# EAGLE design dekatron-sim-4017 (EAGLE 6.4)
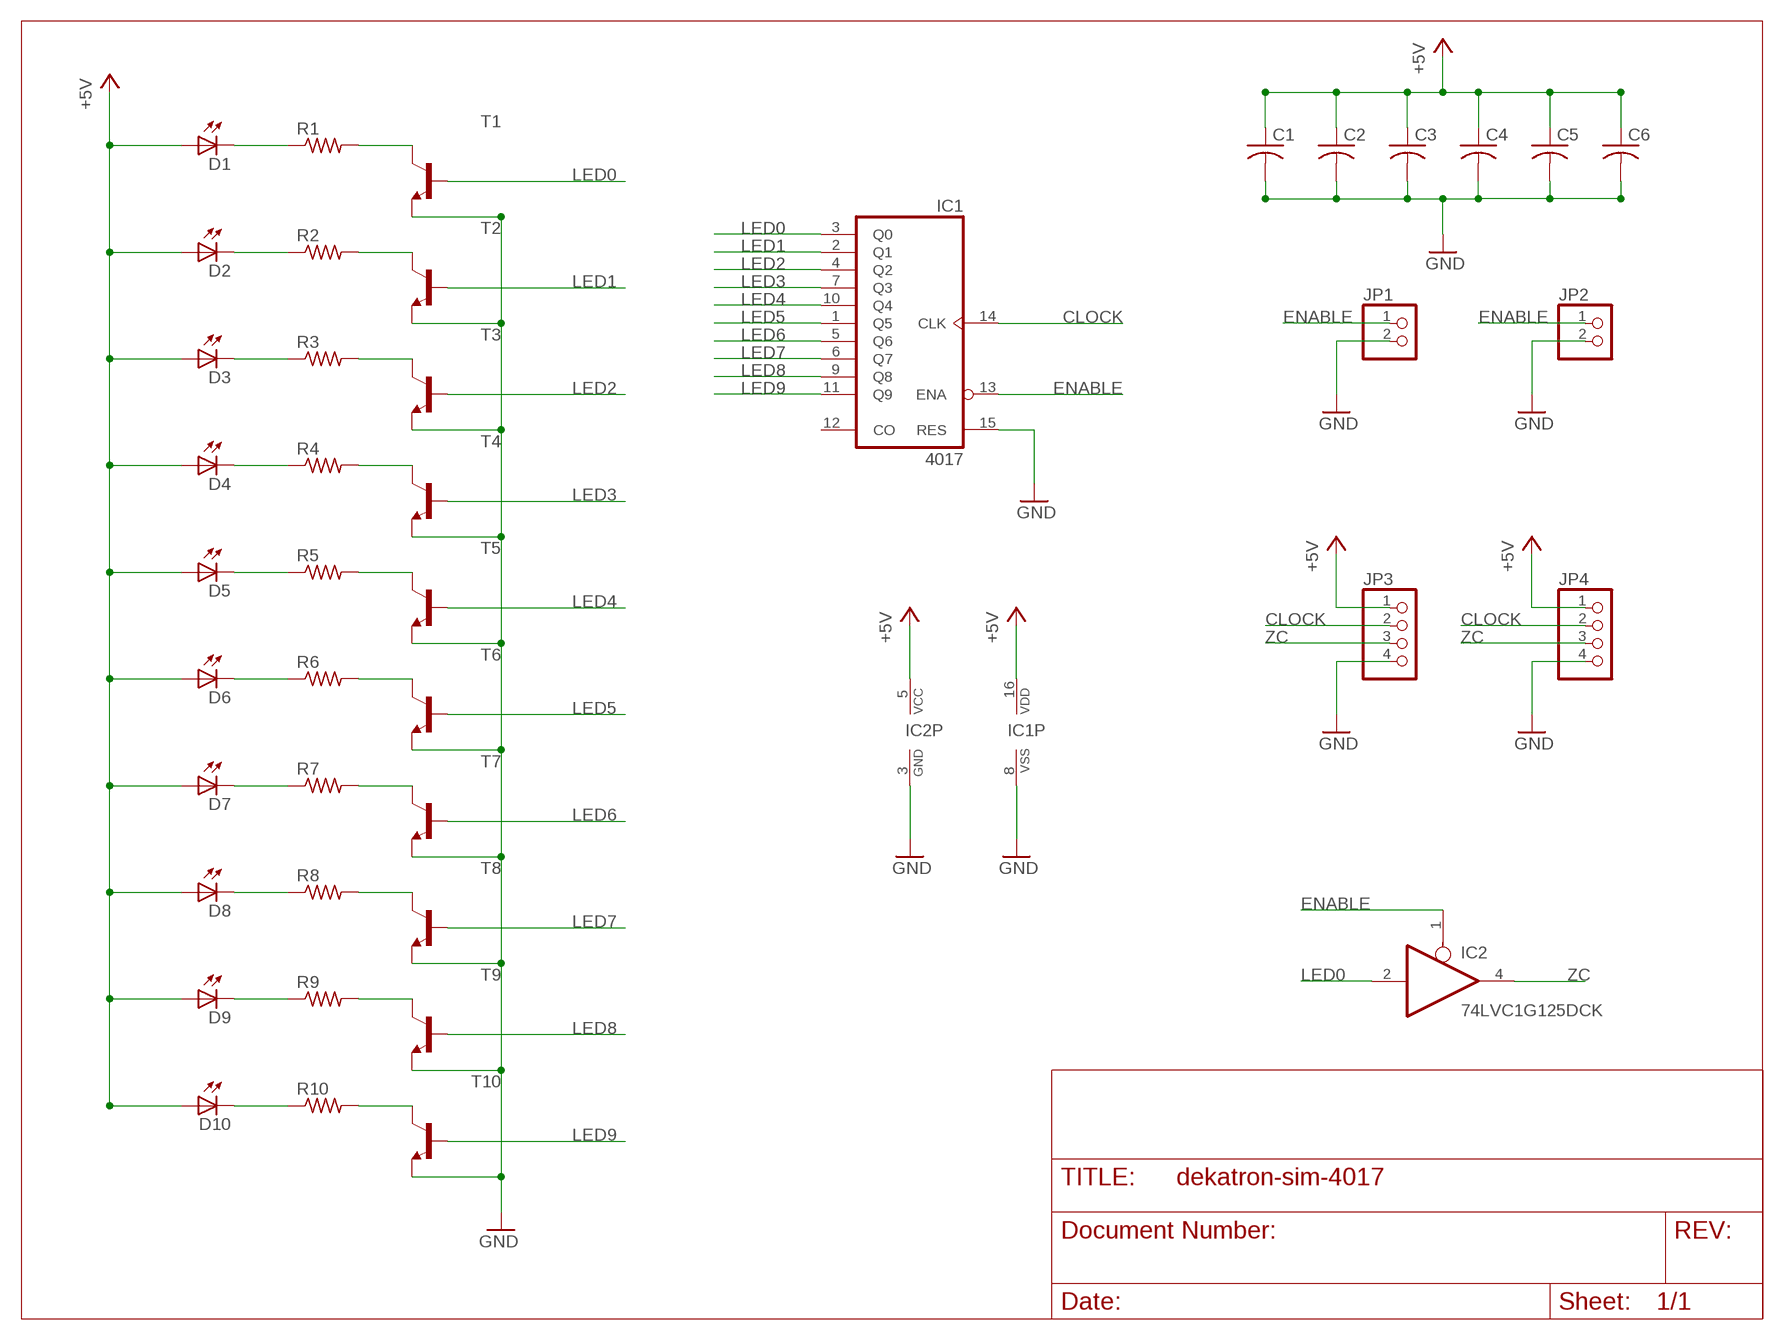
[diagram p0: schematic, sheet 1]

## Parts
C1  C-USC0805  [C0805]
C2  C-USC0805  [C0805]
C3  C-USC0805  [C0805]
C4  C-USC0805  [C0805]
C5  C-USC0805  [C0805]
C6  C-USC0805  [C0805]
D1  RED  LEDCHIP-LED0603  [CHIP-LED0603]
D2  RED  LEDCHIP-LED0603  [CHIP-LED0603]
D3  RED  LEDCHIP-LED0603  [CHIP-LED0603]
D4  RED  LEDCHIP-LED0603  [CHIP-LED0603]
D5  RED  LEDCHIP-LED0603  [CHIP-LED0603]
D6  RED  LEDCHIP-LED0603  [CHIP-LED0603]
D7  RED  LEDCHIP-LED0603  [CHIP-LED0603]
D8  RED  LEDCHIP-LED0603  [CHIP-LED0603]
D9  RED  LEDCHIP-LED0603  [CHIP-LED0603]
D10  RED  LEDCHIP-LED0603  [CHIP-LED0603]
IC1  4017  [TSSOP16]
IC2  74LVC1G125DCK  [SC70-5]
JP1  PINHD-1X2  [1X02]
JP2  PINHD-1X2  [1X02]
JP3  PINHD-1X4  [1X04]
JP4  PINHD-1X4  [1X04]
R1  R-US_R0603  [R0603]
R2  R-US_R0603  [R0603]
R3  R-US_R0603  [R0603]
R4  R-US_R0603  [R0603]
R5  R-US_R0603  [R0603]
R6  R-US_R0603  [R0603]
R7  R-US_R0603  [R0603]
R8  R-US_R0603  [R0603]
R9  R-US_R0603  [R0603]
R10  R-US_R0603  [R0603]
T1  MMBT2222ALT1-NPN-SOT23-BEC  [SOT23-BEC]
T2  MMBT2222ALT1-NPN-SOT23-BEC  [SOT23-BEC]
T3  MMBT2222ALT1-NPN-SOT23-BEC  [SOT23-BEC]
T4  MMBT2222ALT1-NPN-SOT23-BEC  [SOT23-BEC]
T5  MMBT2222ALT1-NPN-SOT23-BEC  [SOT23-BEC]
T6  MMBT2222ALT1-NPN-SOT23-BEC  [SOT23-BEC]
T7  MMBT2222ALT1-NPN-SOT23-BEC  [SOT23-BEC]
T8  MMBT2222ALT1-NPN-SOT23-BEC  [SOT23-BEC]
T9  MMBT2222ALT1-NPN-SOT23-BEC  [SOT23-BEC]
T10  MMBT2222ALT1-NPN-SOT23-BEC  [SOT23-BEC]

## Nets
+5V: C1.1 C2.1 C3.1 C4.1 C5.1 C6.1 D1.A D2.A D3.A D4.A D5.A D6.A D7.A D8.A D9.A D10.A IC1.16(VDD) IC2.5(VCC) JP3.1 JP4.1
CLOCK: IC1.14(CLK) JP3.2 JP4.2
ENABLE: IC1.13(ENA) IC2.1(OE) JP1.1 JP2.1
GND: C1.2 C2.2 C3.2 C4.2 C5.2 C6.2 IC1.8(VSS) IC1.15(RES) IC2.3(GND) JP1.2 JP2.2 JP3.4 JP4.4 T1.E T2.E T3.E T4.E T5.E T6.E T7.E T8.E T9.E T10.E
LED0: IC1.3(Q0) IC2.2(I) T1.B
LED1: IC1.2(Q1) T2.B
LED2: IC1.4(Q2) T3.B
LED3: IC1.7(Q3) T4.B
LED4: IC1.10(Q4) T5.B
LED5: IC1.1(Q5) T6.B
LED6: IC1.5(Q6) T7.B
LED7: IC1.6(Q7) T8.B
LED8: IC1.9(Q8) T9.B
LED9: IC1.11(Q9) T10.B
N$1: R10.2 T10.C
N$2: R9.2 T9.C
N$3: R8.2 T8.C
N$4: D10.C R10.1
N$5: D9.C R9.1
N$6: D8.C R8.1
N$7: D7.C R7.1
N$8: R7.2 T7.C
N$9: D6.C R6.1
N$10: R6.2 T6.C
N$11: D5.C R5.1
N$12: R5.2 T5.C
N$13: D4.C R4.1
N$14: R4.2 T4.C
N$15: D3.C R3.1
N$16: R3.2 T3.C
N$17: D2.C R2.1
N$18: R2.2 T2.C
N$19: D1.C R1.1
N$20: R1.2 T1.C
ZC: IC2.4(O) JP3.3 JP4.3
Unconnected: IC1.12(CO)

## Library data of the parts
C1-C6 = resistor:C-US: CAPACITOR, American symbol
D1-D10 = led:LED: LED OSRAM: - CHIPLED LG R971, LG N971, LY N971, LG Q971, LY Q971, LO R971, LY R971 LH N974, LH R974 LS Q976, LO Q976, LY Q976 LO Q996 - Hyper CHIPLED LW Q18S LB Q993, LB Q99A, LB R99A - SideLED LS A670, LO A670, LY A670, LG A670, LP A670 LB A673, LV A673, LT A673, LW A673 LH A674 LY A675 LS A676, LA A676, LO A676, LY A676, LW A676 LS A679, LY A679, LG A679 - Hyper Micro SIDELED® LS Y876, LA Y876, LO Y876, LY Y876 LT Y87S - SmartLED LW L88C, LW L88S LB L89C, LB L89S, LG L890 LS L89K, LO L89K, LY L89K LS L896, LA L896, LO L896, LY L896 - TOPLED LS T670, LO T670, LY T670, LG T670, LP T670 LSG T670, LSP T670, LSY T670, LOP T670, LYG T670 LG T671, LOG T671, LSG T671 LB T673, LV T673, LT T673, LW T673 LH T674 LS T676, LA T676, LO T676, LY T676, LB T676, LH T676, LSB T676, LW T676 LB T67C, LV T67C, LT T67C, LS T67K, LO T67K, LY T67K, LW E67C LS E67B, LA E67B, LO E67B, LY E67B, LB E67C, LV E67C, LT E67C LW T67C LS T679, LY T679, LG T679 LS T770, LO T770, LY T770, LG T770, LP T770 LB T773, LV T773, LT T773, LW T773 LH T774 LS E675, LA E675, LY E675, LS T675 LS T776, LA T776, LO T776, LY T776, LB T776 LHGB T686 LT T68C, LB T68C - Hyper Mini TOPLED® LB M676 - Mini TOPLED Santana® LG M470 LS M47K, LO M47K, LY M47K Source: http://www.osram.convergy.de LUXEON: - LUMILED® LXK2-PW12-R00, LXK2-PW12-S00, LXK2-PW14-U00, LXK2-PW14-V00 LXK2-PM12-R00, LXK2-PM12-S00, LXK2-PM14-U00 LXK2-PE12-Q00, LXK2-PE12-R00, LXK2-PE12-S00, LXK2-PE14-T00, LXK2-PE14-U00 LXK2-PB12-K00, LXK2-PB12-L00, LXK2-PB12-M00, LXK2-PB14-N00, LXK2-PB14-P00, LXK2-PB14-Q00 LXK2-PR12-L00, LXK2-PR12-M00, LXK2-PR14-Q00, LXK2-PR14-R00 LXK2-PD12-Q00, LXK2-PD12-R00, LXK2-PD12-S00 LXK2-PH12-R00, LXK2-PH12-S00 LXK2-PL12-P00, LXK2-PL12-Q00, LXK2-PL12-R00 Source: www.luxeon.com KINGBRIGHT: KA-3528ASYC Source: www.kingbright.com
IC1 = 40xx:4017: COUNTER/DIVIDER
IC2 = 74xx-little-us:74*1G125: Single Bus Buffer Gate with 3-State Output
JP1 JP2 = pinhead:PINHD-1X2: PIN HEADER
JP3 JP4 = pinhead:PINHD-1X4: PIN HEADER
R1-R10 = resistor:R-US_: RESISTOR, American symbol
T1-T10 = transistor:*-NPN-: NPN Transistror BF959 corrected 2008.03.06

## Board
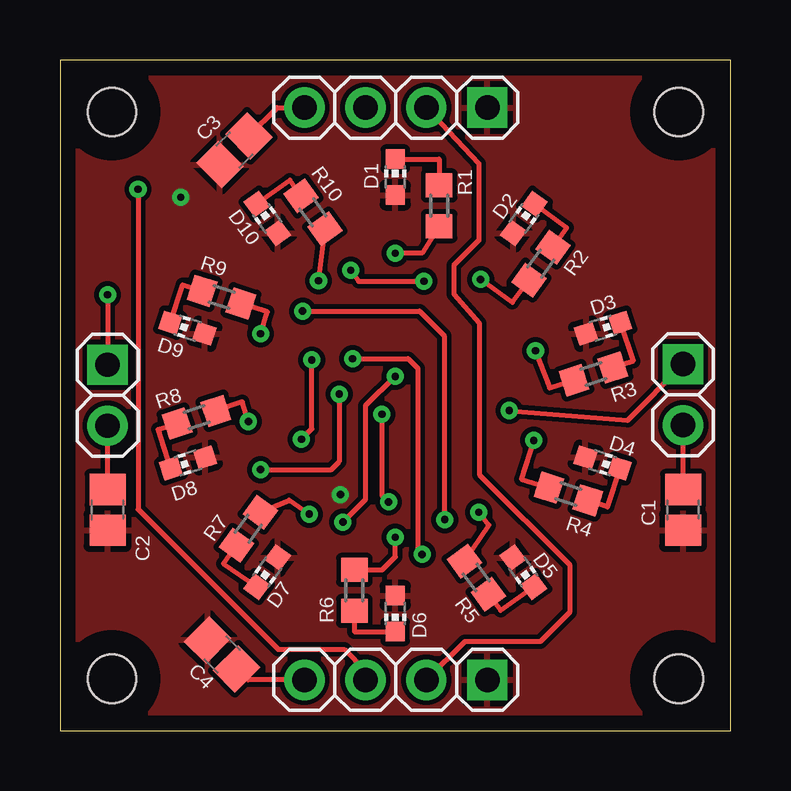
[diagram p1: board, top side]
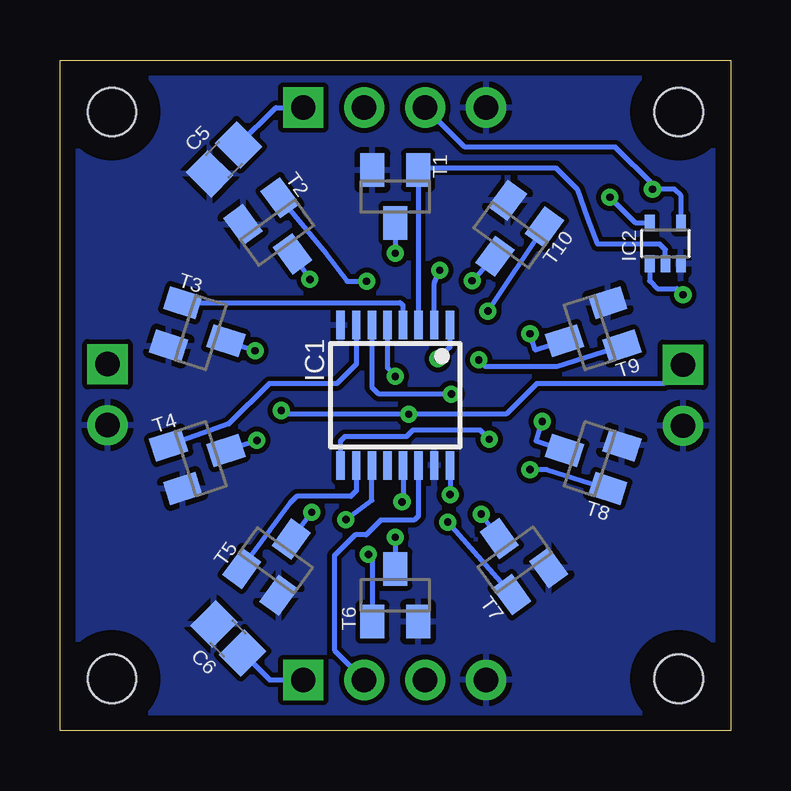
[diagram p2: board, bottom side, seen from below]

Size 27.94 x 27.94 mm. Coordinates in mm from the lower left corner, seen from the top.
Outline: 27.94,27.94 0,27.94 0,0 27.94,0 27.94,27.94
Copper layers (1*16): Top 0.035mm / dielectric 1.5mm / Bottom 0.035mm
Design rules "default *": minimum track width 8mil, minimum drill 12mil, track to track 8mil, track to pad 8mil, pad to pad 8mil, via to via 8mil, smd to smd 8mil, copper to edge 25mil, drill to drill 8mil, minimum pad ring 10mil, minimum via ring 8mil, stop-mask expansion 4mil, vias tented up to drill 0mil, thermal gap 10mil
Holes 2.01 mm at 2.16,2.16 25.78,2.16 25.78,25.78 2.16,25.78
tRestrict: area 23.8,0.2 to 27.8,4.2; area 23.8,23.8 to 27.8,27.8; area 0.2,23.8 to 4.2,27.8; area 0.2,0.2 to 4.2,4.2
bRestrict: area 23.8,0.2 to 27.8,4.2; area 23.8,23.8 to 27.8,27.8; area 0.2,23.8 to 4.2,27.8; area 0.2,0.2 to 4.2,4.2

### Footprints (pad centres in the part's own frame; a part is rotated, then mirrored left to right if it is on the bottom)
C0805 = smd 1.3 x 1.5: 1 -0.85,0; 2 0.85,0
CHIP-LED0603 = smd 0.8 x 0.8: A 0,-0.75; C 0,0.75
TSSOP16 = smd 0.35 x 1.2: 1 -2.275,-2.925; 2 -1.625,-2.925; 3 -0.975,-2.925; 4 -0.325,-2.925; 5 0.325,-2.925; 6 0.975,-2.925; 7 1.625,-2.925; 8 2.275,-2.925; 9 2.275,2.925; 10 1.625,2.925; 11 0.975,2.925; 12 0.325,2.925; 13 -0.325,2.925; 14 -0.975,2.925; 15 -1.625,2.925; 16 -2.275,2.925
SC70-5 = smd 0.4 x 0.7: 1 -0.65,-0.85; 2 0,-0.85; 3 0.65,-0.85; 4 0.65,0.85; 5 -0.65,0.85
1X02 = drill 1.016 pad 1.676 square: 1 -1.27,0 | drill 1.016 pad 1.676: 2 1.27,0
1X04 = drill 1.016 pad 1.676 square: 1 -3.81,0 | drill 1.016 pad 1.676: 2 -1.27,0; 3 1.27,0; 4 3.81,0
R0603 = smd 1 x 1.1: 1 -0.85,0; 2 0.85,0
SOT23-BEC = smd 1 x 1.4: B -0.95,-1.1; C 0,1.1; E 0.95,-1.1

### Placement (x,y rotation side)
C1  25.96,9.19 90 top
C2  1.98,9.19 90 top
C3  7.26,24.18 45 top
C4  6.76,3.17 315 top
C5  21.11,23.8 225 bottom
C6  20.93,3.84 135 bottom
D1  13.97,23.06 0 top
D2  19.33,21.34 324 top
D3  22.63,16.76 288 top
D4  22.61,11.15 252 top
D5  19.3,6.6 216 top
D6  13.97,4.88 180 top
D7  8.64,6.6 144 top
D8  5.33,11.15 108 top
D9  5.31,16.76 72 top
D10  8.64,21.34 36 top
IC1  13.97,13.97 180 bottom
IC2  2.72,20.29 0 bottom
JP1  1.98,13.97 270 top
JP2  25.96,14 270 top
JP3  14,25.96 180 top
JP4  14,2.11 180 top
R1  15.8,21.87 270 top
R2  20.04,19.46 234 top
R3  22.23,14.86 198 top
R4  21.18,9.86 162 top
R5  17.35,6.38 126 top
R6  12.27,5.84 90 top
R7  7.85,8.41 54 top
R8  5.69,13.06 18 top
R9  6.73,18.06 342 top
R10  10.54,21.59 306 top
T1  13.97,22.25 180 bottom
T2  18.9,20.75 216 bottom
T3  22.07,16.59 252 bottom
T4  22.07,11.33 288 bottom
T5  18.95,7.09 324 bottom
T6  13.97,5.64 0 bottom
T7  8.99,7.11 36 bottom
T8  5.87,11.33 72 bottom
T9  5.87,16.59 108 bottom
T10  9.17,20.65 144 bottom

### Tracks (layer width: path | path; a pad name or v marks a point on that pad's centre or on a via)
+5V  (via drill 0.3)
  Bottom 0.203: IC1.16 11.68,11.03 v11.68,9.83 | C5.1 18.95,25.96 JP3.1 | C6.1 19.2,2.11 JP4.1 | IC2.5 3.95,21.14 v5.03,22.23
  pour Top: 27.94,0 0,0 0,27.94 27.94,27.94
CLOCK
  Top 0.203: JP3.2 17.45,23.62 17.45,20.42 16.41,19.38 16.41,18.19 17.48,16.97 17.48,10.67 21.23,6.91 21.23,4.93 20.02,3.71 16.87,3.71 JP4.2
  Bottom 0.203: JP4.2 16.51,3.35 16.51,7.29 15.65,8.15 15.19,8.15 14.58,8.76 13.18,8.76 12.99,8.95 IC1.14
ENABLE  (via drill 0.3)
  Top 0.203: v13.41,13.18 13.41,9.8 v13.69,9.53 | v1.98,18.16 JP1.1 | JP2.1 23.65,12.93 v18.72,13.34
  Bottom 0.203: JP1.1 2.77,14.45 8.08,14.45 9.35,13.18 v13.41,13.18 18.57,13.18 v18.72,13.34 | IC1.13 13.64,9.57 v13.69,9.53 | IC2.1 3.37,18.73 3.05,18.41 2.23,18.41 v1.98,18.16
GND
  Top 0.203: C2.2 JP1.2 | C1.2 JP2.2 | C3.2 9.04,25.96 JP3.4 | JP4.4 7.82,2.11 C4.2
  pour Bottom: 27.94,0 0,0 0,27.94 27.94,27.94
LED0
  Bottom 0.203: IC1.3 13.02,16.92 T1.B 13.01,23.47 arc-90 12.91,23.44 7.29,23.44 6.38,22.53 5.94,21.34 5.54,20.27 2.95,20.27 2.72,20.04 IC2.2
LED1  (via drill 0.3)
  Top 0.203: v12.12,19.18 12.45,18.72 v15.16,18.72
  Bottom 0.203: IC1.2 12.35,18.64 v12.12,19.18 | T2.B 16.87,19.89 15.98,18.72 v15.16,18.72
LED2
  Bottom 0.203: IC1.4 13.64,17.71 13.77,17.83 T3.B
LED3
  Bottom 0.203: IC1.7 15.6,15.27 16.41,14.45 19.23,14.45 20.9,12.78 T4.B
LED4
  Bottom 0.203: T5.B 18.34,9.5 18.09,9.75 15.82,9.75 15.6,9.98 IC1.10
LED5  (via drill 0.3)
  Top 0.203: v12.19,15.49 14.5,15.49 14.91,15.09 14.91,7.59 v15.09,7.34
  Bottom 0.203: IC1.1 11.7,15.97 v12.19,15.49 | T6.B 14.92,7.07 v15.09,7.34
LED6  (via drill 0.3)
  Top 0.203: v13.97,14.76 12.72,13.54 12.72,9.63 v11.79,8.69
  Bottom 0.203: IC1.5 14.29,15.11 v13.97,14.76 | v11.79,8.69 T7.B
LED7  (via drill 0.3)
  Top 0.203: v8.36,10.87 11.3,10.87 11.63,11.2 v11.63,14.02
  Bottom 0.203: IC1.6 14.95,14.31 14.66,14.02 v11.63,14.02 | T8.B 7.64,10.87 v8.36,10.87
LED8  (via drill 0.3)
  Top 0.203: v10.06,12.14 10.49,12.57 v10.49,15.44
  Bottom 0.203: T9.B 7.24,15.16 10.21,15.16 v10.49,15.44 | IC1.9 16.26,12.06 16.08,12.24 13.51,12.24 13.23,12.52 10.44,12.52 v10.06,12.14
LED9  (via drill 0.3)
  Top 0.203: v10.11,17.48 14.99,17.48 16,16.46 16,9.09 v16.03,8.79
  Bottom 0.203: T10.B v10.11,17.48 | v16.03,8.79 14.95,9.59 IC1.11
N$1  (via drill 0.3)
  Top 0.203: R10.2 v10.77,18.75
  Bottom 0.203: T10.C v10.77,18.75
N$2  (via drill 0.3)
  Top 0.203: v8.36,16.54 8.64,17.45 R9.2
  Bottom 0.203: T9.C 8.13,15.85 v8.36,16.54
N$3  (via drill 0.3)
  Top 0.203: v7.85,12.88 7.59,13.69 R8.2
  Bottom 0.203: T8.C 8.1,12.06 v7.85,12.88
N$4
  Top 0.203: D10.C 9.58,22.94 R10.1
N$5
  Top 0.203: D9.C 5.11,18.57 R9.1
N$6
  Top 0.203: D8.C 4.09,12.55 R8.1
N$7
  Top 0.203: R7.1 6.81,6.96 D7.C
N$8  (via drill 0.3)
  Top 0.203: v10.39,9.02 9.55,9.6 R7.2
  Bottom 0.203: T7.C v10.39,9.02
N$9
  Top 0.203: R6.1 12.27,4.13 D6.C
N$10  (via drill 0.3)
  Top 0.203: R6.2 13.42,6.69 13.97,7.24 v13.97,8.05
  Bottom 0.203: v13.97,8.05 T6.C
N$11
  Top 0.203: R5.1 18.36,5 D5.C
N$12  (via drill 0.3)
  Top 0.203: 17.04,7.26 R5.2 17.87,8.56 v17.45,9.09
  Bottom 0.203: T5.C v17.45,9.09
N$13
  Top 0.203: D4.C 22.81,9.32 R4.1
N$14  (via drill 0.3)
  Top 0.203: R4.2 19.22,10.47 v19.74,12.09
  Bottom 0.203: T4.C v19.74,12.09
N$15
  Top 0.203: D3.C 23.88,15.39 R3.1
N$16  (via drill 0.3)
  Top 0.203: R3.2 20.4,14.28 v19.81,15.82
  Bottom 0.203: T3.C v19.81,15.82
N$17
  Top 0.203: D2.C 21.11,20.95 R2.1
N$18  (via drill 0.3)
  Top 0.203: R2.2 18.85,17.85 v17.53,18.8
  Bottom 0.203: T2.C v17.53,18.8
N$19
  Top 0.203: D1.C 15.8,23.81 R1.1
N$20  (via drill 0.3)
  Top 0.203: R1.2 15.09,19.89 v13.97,19.89
  Bottom 0.203: T1.C v13.97,19.89
ZC  (via drill 0.3)
  Top 0.203: JP4.3 12.72,2.49 11.84,3.38 9.09,3.38 3.25,9.22 v3.25,22.55
  Bottom 0.203: IC2.4 arc-90 2.06,21.16 2.06,22.28 2.34,22.55 v3.25,22.55 3.25,22.76 4.8,24.31 11.07,24.31 JP3.3

### Text on the board
Document: 0 | 9 | 1 | www.witch-e.org | Dekatron Simulator | 8 | 2 | 7 | 3 | 6 | 4 | 5